# EAGLE schematic bbiq_prototype (EAGLE 9.1.0)
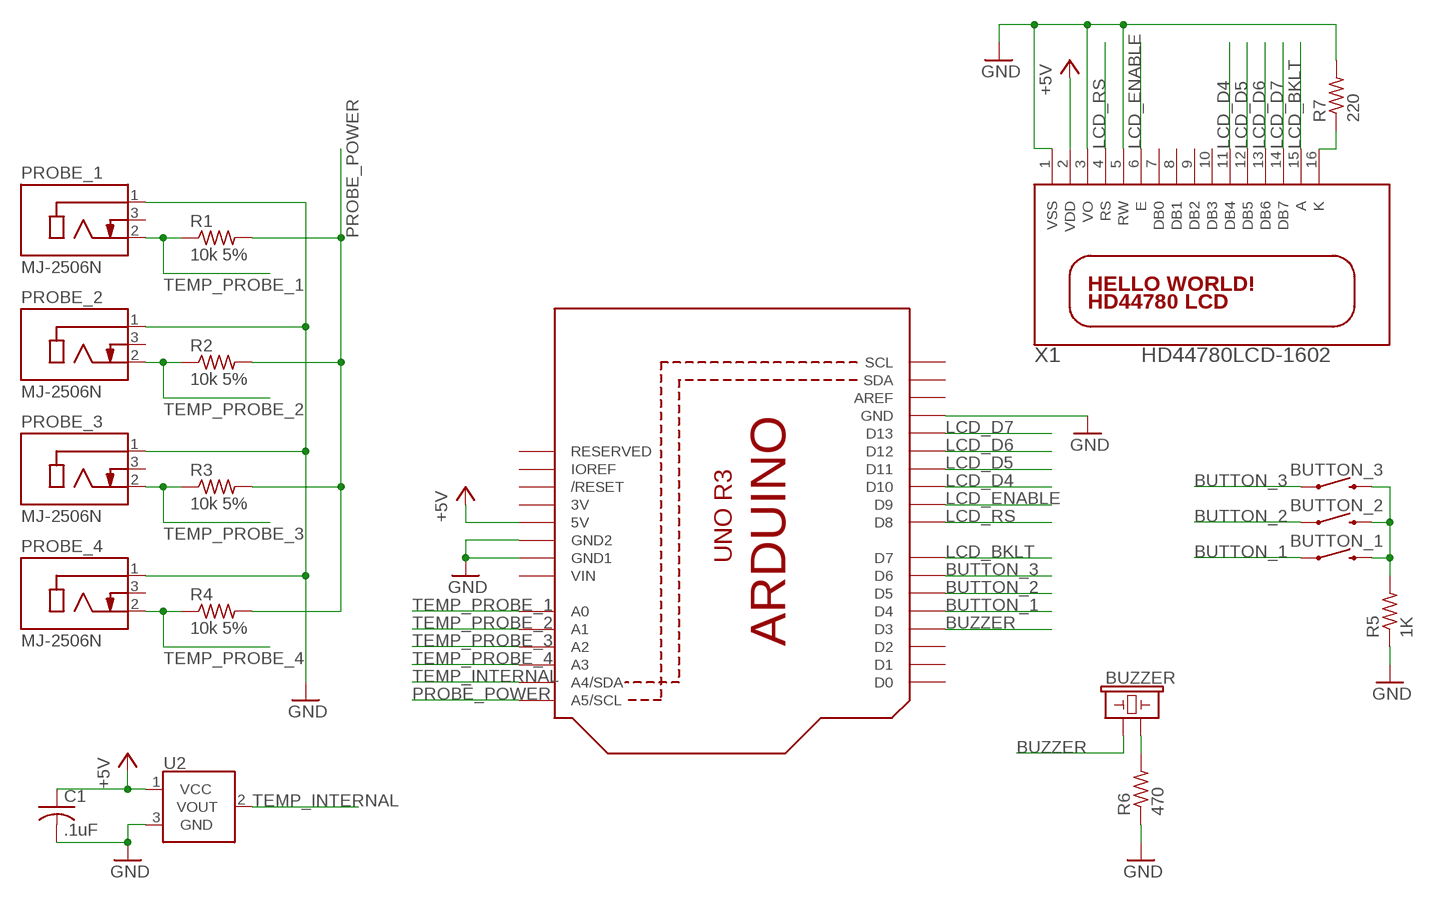
[diagram p0: schematic, sheet 1]

## Parts
BUTTON_1  MOMENTARY-SWITCH-SPST-PTH-12MM  [TACTILE_SWITCH_PTH_12MM]
BUTTON_2  MOMENTARY-SWITCH-SPST-PTH-12MM  [TACTILE_SWITCH_PTH_12MM]
BUTTON_3  MOMENTARY-SWITCH-SPST-PTH-12MM  [TACTILE_SWITCH_PTH_12MM]
BUZZER  BUZZER-PTH  [BUZZER-12MM]
C1  .1uF  C-US025-025X050  [C025-025X050]
PROBE_1  MJ-2506N  [CUI_MJ-2506N]
PROBE_2  MJ-2506N  [CUI_MJ-2506N]
PROBE_3  MJ-2506N  [CUI_MJ-2506N]
PROBE_4  MJ-2506N  [CUI_MJ-2506N]
R1  10k 5%  R-US_0207/10  [0207/10]
R2  10k 5%  R-US_0207/10  [0207/10]
R3  10k 5%  R-US_0207/10  [0207/10]
R4  10k 5%  R-US_0207/10  [0207/10]
R5  1K  R-US_0207/10  [0207/10]
R6  470  R-US_0207/10  [0207/10]
R7  220  R-US_0207/10  [0207/10]
U1  ARDUINOR3-BPLACE  [ARDUINOR3-BPLACE]
U2  TMP36GT9  [TO-92]
X1  HD44780LCD-1602  [LCD1602]

## Nets
+5V: C1.1 U1.5V U2.1(VCC) X1.2(VDD)
BUTTON_1: BUTTON_1.1 U1.D4
BUTTON_2: BUTTON_2.1 U1.D5
BUTTON_3: BUTTON_3.1 U1.D6
BUZZER: BUZZER.+ U1.D3
GND: C1.2 PROBE_1.1 PROBE_2.1 PROBE_3.1 PROBE_4.1 R5.1 R6.1 R7.2 U1.GND U1.GND1 U1.GND2 U2.3(GND) X1.1(VSS) X1.3(VO) X1.5(RW)
LCD_BKLT: U1.D7 X1.15(A)
LCD_D4: U1.D10 X1.11(DB4)
LCD_D5: U1.D11 X1.12(DB5)
LCD_D6: U1.D12 X1.13(DB6)
LCD_D7: U1.D13 X1.14(DB7)
LCD_ENABLE: U1.D9 X1.6(E)
LCD_RS: U1.D8 X1.4(RS)
N$1: BUTTON_1.3 BUTTON_2.3 BUTTON_3.3 R5.2
N$2: BUZZER.- R6.2
N$3: R7.1 X1.16(K)
PROBE_POWER: R1.2 R2.2 R3.2 R4.2 U1.A5(A5/SCL)
TEMP_INTERNAL: U1.A4(A4/SDA) U2.2(VOUT)
TEMP_PROBE_1: PROBE_1.2 R1.1 U1.A0
TEMP_PROBE_2: PROBE_2.2 R2.1 U1.A1
TEMP_PROBE_3: PROBE_3.2 R3.1 U1.A2
TEMP_PROBE_4: PROBE_4.2 R4.1 U1.A3
Unconnected: PROBE_1.3 PROBE_2.3 PROBE_3.3 PROBE_4.3 U1.AREF U1.D0 U1.D1 U1.D2 U1.IOREF U1.RESERVED U1.RESET(/RESET) U1.SCL U1.SDA X1.7(DB0) X1.8(DB1) X1.9(DB2) X1.10(DB3)

## Power pins joined to a net without a drawn wire
3V: U1.3V
VIN: U1.VIN

## Library data of the parts
BUTTON_1-BUTTON_3 = SparkFun-Switches:MOMENTARY-SWITCH-SPST: Momentary Switch (Pushbutton) - SPST Normally-open (NO) SPST momentary switches (buttons, pushbuttons). Variants PTH-12MM - 12mm square, through-hole Momentary Pushbutton Switch - 12mm Square <https://www.sparkfun.com/products/9190> (COM-09190) PTH-6.0MM, PTH-6.0MM-KIT - 6.0mm square, through-hole Mini Pushbutton Switch <https://www.sparkfun.com/products/97> (COM-00097) KIT package intended for soldering kit's - only one side of pads' copper is exposed. PTH-RIGHT-ANGLE-KIT - Right-angle, through-hole Right Angle Tactile Button <https://www.sparkfun.com/products/10791> - Used on SparkFun BigTime Watch Kit <https://www.sparkfun.com/products/11734> SMD-12MM - 12mm square, surface-mount Tactile Button - SMD (12mm) <https://www.sparkfun.com/products/12993> (COM-12993) Used on SparkFun PicoBoard <https://www.sparkfun.com/products/11888> SMD-4.5MM - 4.5mm Square Trackball Switch Used on SparkFun Blackberry Trackballer Breakout <https://www.sparkfun.com/products/13169> SMD-4.6MMX2.8MM - 4.60mm x 2.80mm, surface mount Used on SparkFun SAMD21 Mini Breakout <https://www.sparkfun.com/products/13664> SMD-5.2MM, SMD-5.2-REDUNDANT - 5.2mm square, surface-mount Mini Pushbutton Switch - SMD <https://www.sparkfun.com/products/8720> (COM-08720) Used on Arduino Pro Mini <https://www.sparkfun.com/products/11114> REDUNDANT package connects both switch circuits together SMD-6.0X3.5MM - 6.0 x 3.5mm, surface mount Momentary Reset Switch SMD <https://www.sparkfun.com/products/8229> (COM-08229) SMD-6.2MM-TALL - 6.2mm square, surface mount Tactile Button - SMD (6mm) <https://www.sparkfun.com/products/12992> Used on SparkFun Digital Sandbox <https://www.sparkfun.com/products/12651> SMD-RIGHT-ANGLE - Right-angle, surface mount Used on SparkFun Block for Intel® Edison - Arduino <https://www.sparkfun.com/products/13036>; PROD_ID: SWCH-09185; SF_SKU: COM-09190
BUZZER = SparkFun-Electromechanical:BUZZER: Buzzer Small round buzzers that operate around the audible 2kHz range. You can use these as speakers to create simple music or user interfaces. Variant Overview: PTH - Mini Speaker - PC Mount 12mm 2.048kHz <https://www.sparkfun.com/products/7950> PTH_KIT - Mini Speaker - PC Mount 12mm 2.048kHz <https://www.sparkfun.com/products/7950> KIT simplifies soldering by adding stop mask to one side of the pads. PTH_NO_SILK - Mini Speaker - PC Mount 12mm 2.048kHz <https://www.sparkfun.com/products/7950> No silkscreen indicator of buzzer outline. PTH_KIT_NO_SILK - Mini Speaker - PC Mount 12mm 2.048kHz <https://www.sparkfun.com/products/7950> KIT package w/o silkscreen SMD - Buzzer Audio Magnetic (CCV-084B16) SMD buzzer used on, e.g. the LilyPad Buzzer <https://www.sparkfun.com/products/8463> and RFID USB Reader <https://www.sparkfun.com/products/9963>. SMD_KIT - Buzzer Audio Magnetic (CCV-084B16) SMD Buzzer with elongated pins to make soldering easier. Used on the SparkFun Simon Says - Surface Mount Soldering Kit <https://www.sparkfun.com/products/10935>.; PROD_ID: COMP-08253; SF_SKU: COM-07950
C1 = rcl:C-US: CAPACITOR, American symbol; SPICEPREFIX: C
PROBE_1-PROBE_4 = MJ-2506N:MJ-2506N: 2.5 mm, Mono, Right Angle, Through Hole, Audio Jack Connector; MANUFACTURER: CUI INC; PART_REV: E; STANDARD: MANUFACTURER RECOMMENDATIONS
R1-R7 = resistor:R-US_: RESISTOR, American symbol
U1 = adafruit:ARDUINOR3: This is a new object for the new Arduino R3 - with extra pins that you may want to use (such as IOref, and duplicated A4/A5
U2 = SparkFun-Sensors:TMP36: TMP36 Precision Analog °C Temperature Sensor The TMP36 is a low voltage, precision centigrade temperature sensor. It provides a voltage output that is linearly proportional to the Celsius temperature. It also doesn’t require any external calibration to provide typical accuracies of ±1°C at +25°C and ±2°C over the −40°C to +125°C temperature range. We like it because it’s so easy to use: Just give the device a ground and 2.7 to 5.5 VDC and read the voltage on the Vout pin. The output voltage can be converted to temperature easily using the scale factor of 10 mV/°C. Datasheet <http://cdn.sparkfun.com/datasheets/Sensors/Temp/TMP35_36_37.pdf> SparkFun Products Temperature Sensor - TMP36 <https://www.sparkfun.com/products/10988> (SEN-10988) SparkFun Danger Shield <https://www.sparkfun.com/products/11649> (DEV-11649); PROD_ID: IC-09880; SF_ID: SEN-10988
X1 = adafruit:HD44780LCD: HD44780 LCD Standard character type LCDs, available in sizes from 8x1 to 40x4!